# Altium schematic sheet 1_Rectifier.SCHDOC
size 297 x 209 mm; SheetNumber: 1; SheetTotal: 18; DocumentName: 1_Rectifier.SCHDOC
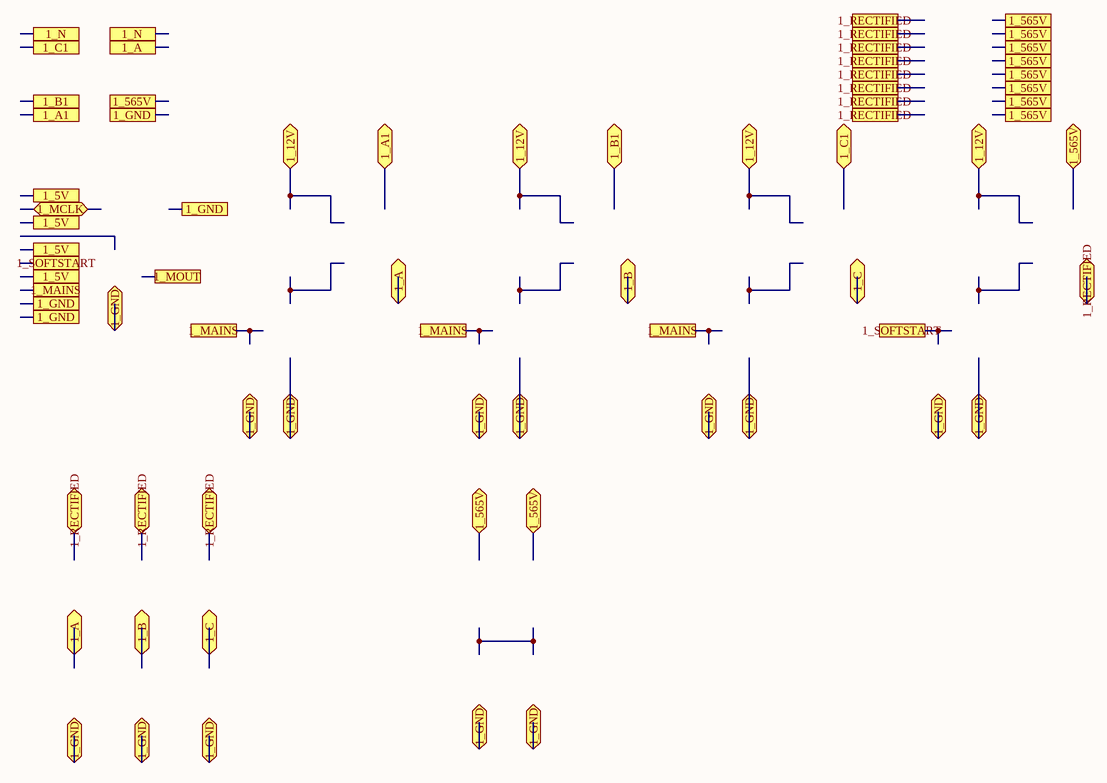
[diagram p0: 1_Rectifier.SCHDOC]

## Ports
1_5V, 1_12V, 1_565V, 1_A, 1_A1, 1_B, 1_B1, 1_C, 1_C1, 1_GND, 1_MAINS, 1_MCLK (bidir), 1_MOUT, 1_N, 1_RECTIFIED, 1_SOFTSTART

## Notes on the sheet
- A
- B
- C
- D
- 1
- 2
- 3
- Title
- 4
- Size
- A4
- Number
- Rev
- Date
- Filename
- Drawn by
- Sheet
- of